# Altium schematic sheet Master.SchDoc
size A; SheetNumber: 1; SheetTotal: 4
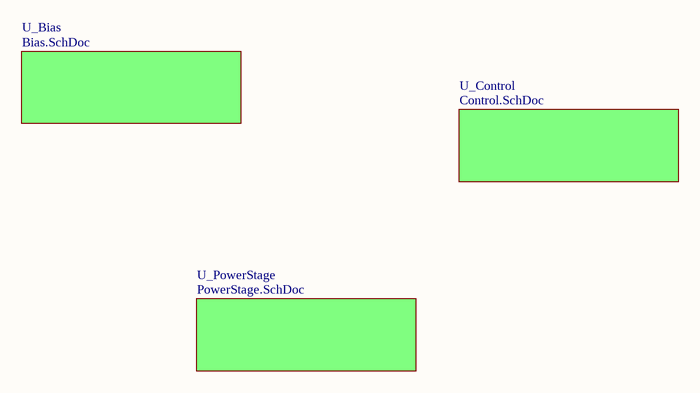
[diagram p0: Master.SchDoc]

## Sub-sheets
U_Bias = Bias.SchDoc: no entries
U_Control = Control.SchDoc: no entries
U_PowerStage = PowerStage.SchDoc: no entries